# Altium schematic sheet BDAN_CPU.SchDoc
size A4; SheetNumber: 2; SheetTotal: 5
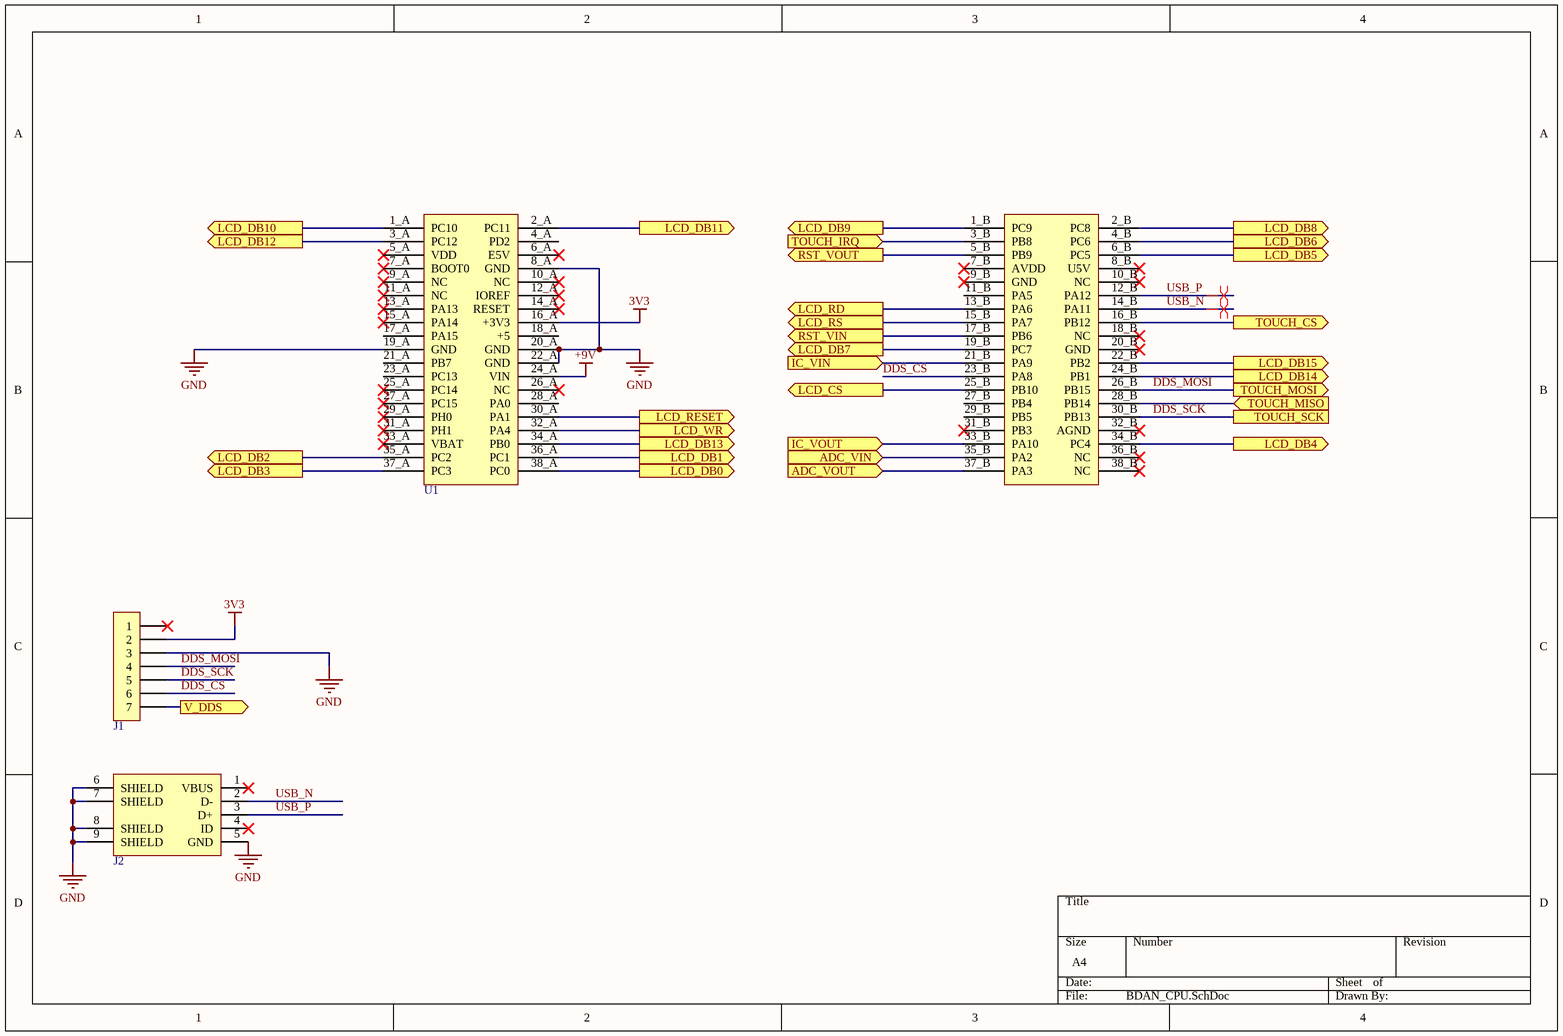
[diagram p0: BDAN_CPU.SchDoc]

## Parts
J1  RECEPTACULO 7POS 0.1"  [SIPF7]  (value not drawn)
J2  MINIUSB_FEMALE_SMD  [USB_MINI_FEMALE]  (value not drawn)
U1  NUCLEO-F401RE  [NUCLEO-F401RE]  (value not drawn)

## Ports
ADC_VIN (in), ADC_VOUT (in), IC_VIN (in), IC_VOUT (in), LCD_CS (out), LCD_DB0 (out), LCD_DB1 (out), LCD_DB2 (out), LCD_DB3 (out), LCD_DB4 (out), LCD_DB5 (out), LCD_DB6 (out), LCD_DB7 (out), LCD_DB8 (out), LCD_DB9 (out), LCD_DB10 (out), LCD_DB11 (out), LCD_DB12 (out), LCD_DB13 (out), LCD_DB14 (out), LCD_DB15 (out), LCD_RD (out), LCD_RESET (out), LCD_RS (out), LCD_WR (out), RST_VIN (out), RST_VOUT (out), TOUCH_CS (out), TOUCH_IRQ (in), TOUCH_MISO (in), TOUCH_MOSI (out), TOUCH_SCK, V_DDS (out)

## Nets
3V3: J1.2 U1.16_A(+3V3)
+9V: U1.24_A(VIN)
GND: J1.3 J2.5(GND) J2.6(SHIELD) J2.7(SHIELD) J2.8(SHIELD) J2.9(SHIELD) U1.8_A(GND) U1.19_A(GND) U1.20_A(GND) U1.22_A(GND)
ADC_VIN: U1.35_B(PA2) ; port ADC_VIN
ADC_VOUT: U1.37_B(PA3) ; port ADC_VOUT
DDS_CS: J1.6 U1.23_B(PA8)
DDS_MOSI: J1.4 U1.26_B(PB15) ; port TOUCH_MOSI
DDS_SCK: J1.5 U1.30_B(PB13) ; port TOUCH_SCK
IC_VIN: U1.21_B(PA9) ; port IC_VIN
IC_VOUT: U1.33_B(PA10) ; port IC_VOUT
LCD_CS: U1.25_B(PB10) ; port LCD_CS
LCD_DB0: U1.38_A(PC0) ; port LCD_DB0
LCD_DB1: U1.36_A(PC1) ; port LCD_DB1
LCD_DB2: U1.35_A(PC2) ; port LCD_DB2
LCD_DB3: U1.37_A(PC3) ; port LCD_DB3
LCD_DB4: U1.34_B(PC4) ; port LCD_DB4
LCD_DB5: U1.6_B(PC5) ; port LCD_DB5
LCD_DB6: U1.4_B(PC6) ; port LCD_DB6
LCD_DB7: U1.19_B(PC7) ; port LCD_DB7
LCD_DB8: U1.2_B(PC8) ; port LCD_DB8
LCD_DB9: U1.1_B(PC9) ; port LCD_DB9
LCD_DB10: U1.1_A(PC10) ; port LCD_DB10
LCD_DB11: U1.2_A(PC11) ; port LCD_DB11
LCD_DB12: U1.3_A(PC12) ; port LCD_DB12
LCD_DB13: U1.34_A(PB0) ; port LCD_DB13
LCD_DB14: U1.24_B(PB1) ; port LCD_DB14
LCD_DB15: U1.22_B(PB2) ; port LCD_DB15
LCD_RD: U1.13_B(PA6) ; port LCD_RD
LCD_RESET: U1.30_A(PA1) ; port LCD_RESET
LCD_RS: U1.15_B(PA7) ; port LCD_RS
LCD_WR: U1.32_A(PA4) ; port LCD_WR
RST_VIN: U1.17_B(PB6) ; port RST_VIN
RST_VOUT: U1.5_B(PB9) ; port RST_VOUT
TOUCH_CS: U1.16_B(PB12) ; port TOUCH_CS
TOUCH_IRQ: U1.3_B(PB8) ; port TOUCH_IRQ
TOUCH_MISO: U1.28_B(PB14) ; port TOUCH_MISO
USB_N: J2.2(D-) U1.14_B(PA11)
USB_P: J2.3(D+) U1.12_B(PA12)
V_DDS: J1.7 ; port V_DDS

Not connected (* = marked no-connect by the designer): J1 1*; J2 1(VBUS)* 4(ID)*; U1 4_A(PD2) 5_A(VDD)* 6_A(E5V)* 7_A(BOOT0)* 7_B(AVDD)* 8_B(U5V)* 9_A(NC)* 9_B(GND)* 10_A(NC)* 10_B(NC)* 11_A(NC)* 11_B(PA5) 12_A(IOREF)* 13_A(PA13)* 14_A(RESET)* 15_A(PA14)* 17_A(PA15) 18_A(+5) 18_B(NC)* 20_B(GND)* 21_A(PB7) 23_A(PC13) 25_A(PC14)* 26_A(NC)* 27_A(PC15)* 27_B(PB4) 28_A(PA0) 29_A(PH0)* 29_B(PB5) 31_A(PH1)* 31_B(PB3)* 32_B(AGND)* 33_A(VBAT)* 36_B(NC)* 38_B(NC)*

## Layout directives
differential pair: USB_N, USB_P

## Library data of the parts
J1 = RECEPTACLE_7POS_0.1": RECEPTACULO 1x7 POS 0.1"; Publico: JP; Part Number: RECEPTACLE_7POS_0.1"; Value: RECEPTACULO 7POS 0.1"; Supplier 1: ElectroComponentes; Aprobo: -
J2 = CON_MINIUSB_FEMALE_SMD: CONECTOR MINIUSB FEMALE_SMD; Publico: EB; Part Number: CON_MINIUSB_FEMALE_SMD; Value: MINIUSB_FEMALE_SMD; Supplier 1: ElectroComponentes; Aprobo: -
U1 = NUCLEO-F401RE: Manufacturer: STMicroelectronics; Publico: JP; Part Number: NUCLEO-F401RE; Value: NUCLEO-F401RE; Manufacturer Part Number: NUCLEO-F401RE; Supplier 1: Digi-Key